# Altium schematic sheet Powerboard_schematic_top.SchDoc
size A
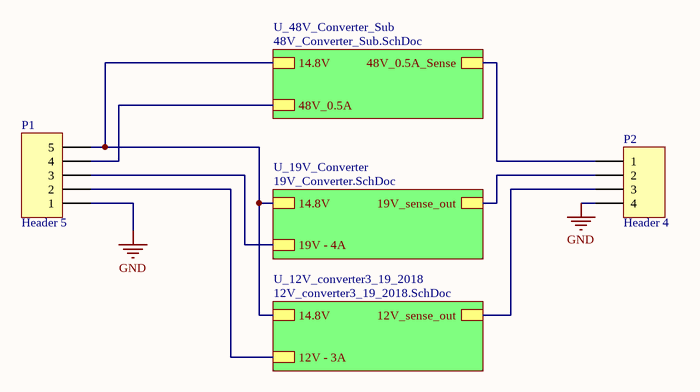
[diagram p0: Powerboard_schematic_top.SchDoc]

## Parts
P1  Header 5  [HDR1X5]
P2  Header 4  [HDR1X4]

## Sub-sheets
U_12V_converter3_19_2018 = 12V_converter3_19_2018.SchDoc: 14.8V, 12V - 3A, 12V_sense_out
U_19V_Converter = 19V_Converter.SchDoc: 14.8V, 19V - 4A, 19V_sense_out
U_48V_Converter_Sub = 48V_Converter_Sub.SchDoc: 48V_0.5A_Sense, 48V_0.5A, 14.8V

## Nets
GND: P1.1 P2.4
NetP1_2: P1.2 ; sheet U_12V_converter3_19_2018/12V - 3A
NetP1_3: P1.3 ; sheet U_19V_Converter/19V - 4A
NetP1_4: P1.4 ; sheet U_48V_Converter_Sub/48V_0.5A
NetP1_5: P1.5 ; sheet U_19V_Converter/14.8V, sheet U_48V_Converter_Sub/14.8V, sheet U_12V_converter3_19_2018/14.8V
NetP2_1: P2.1 ; sheet U_48V_Converter_Sub/48V_0.5A_Sense
NetP2_2: P2.2 ; sheet U_19V_Converter/19V_sense_out
NetP2_3: P2.3 ; sheet U_12V_converter3_19_2018/12V_sense_out

## Library data of the parts
P1 = Header 5: Header, 5-Pin; LatestRevisionDate: 17-Jul-2002; LatestRevisionNote: Re-released for DXP Platform.; Publisher: Altium Limited
P2 = Header 4: Header, 4-Pin; LatestRevisionDate: 17-Jul-2002; LatestRevisionNote: Re-released for DXP Platform.; Publisher: Altium Limited